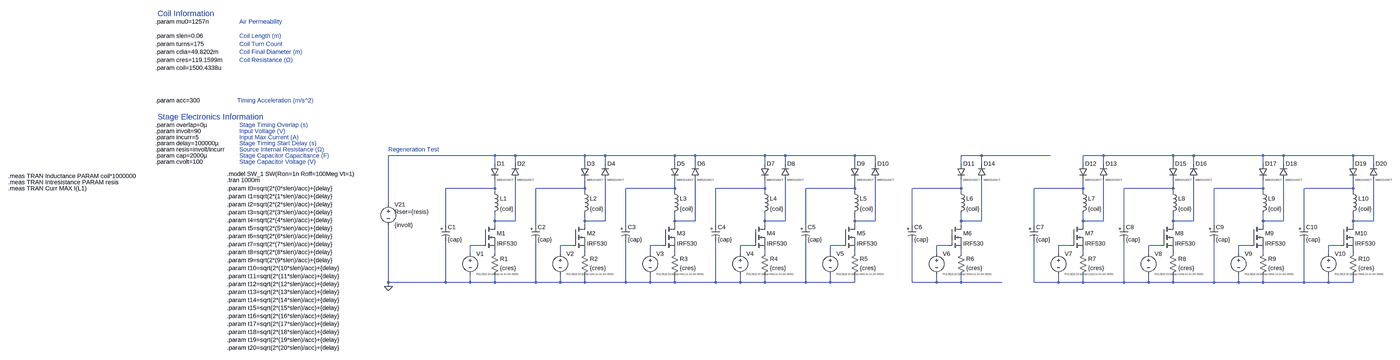
[diagram p0: schematic coilgun6.asc, whole sheet]
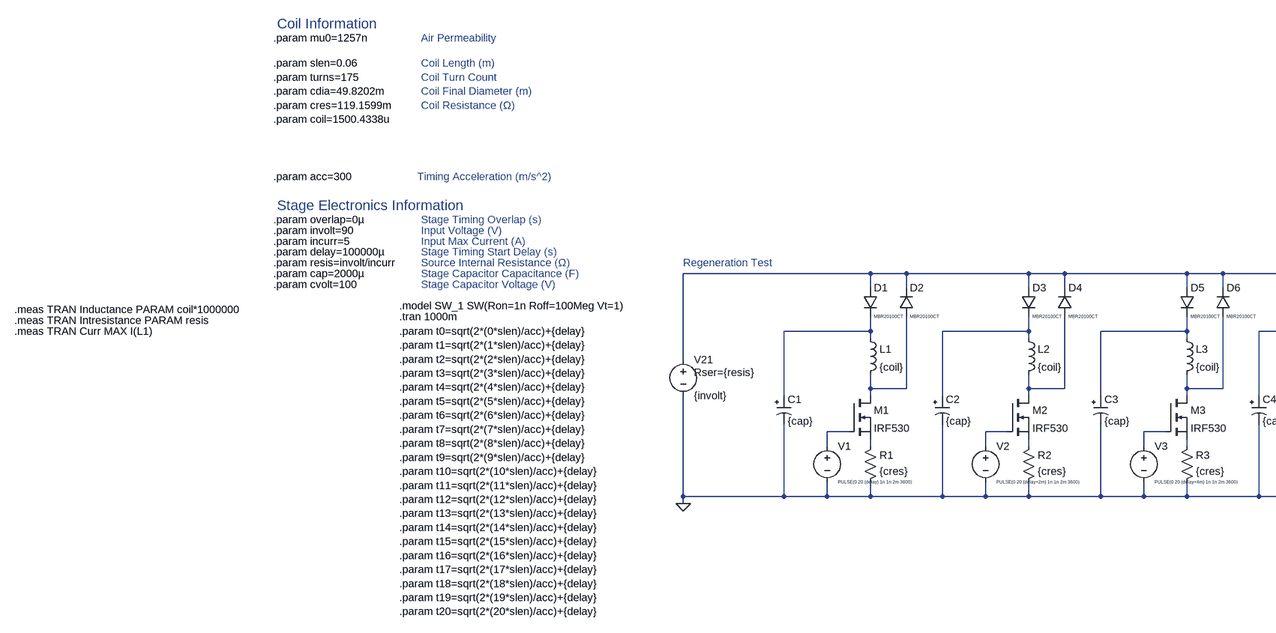
[diagram p1: schematic coilgun6.asc, part, row 1 of 1, column 1 of 2]
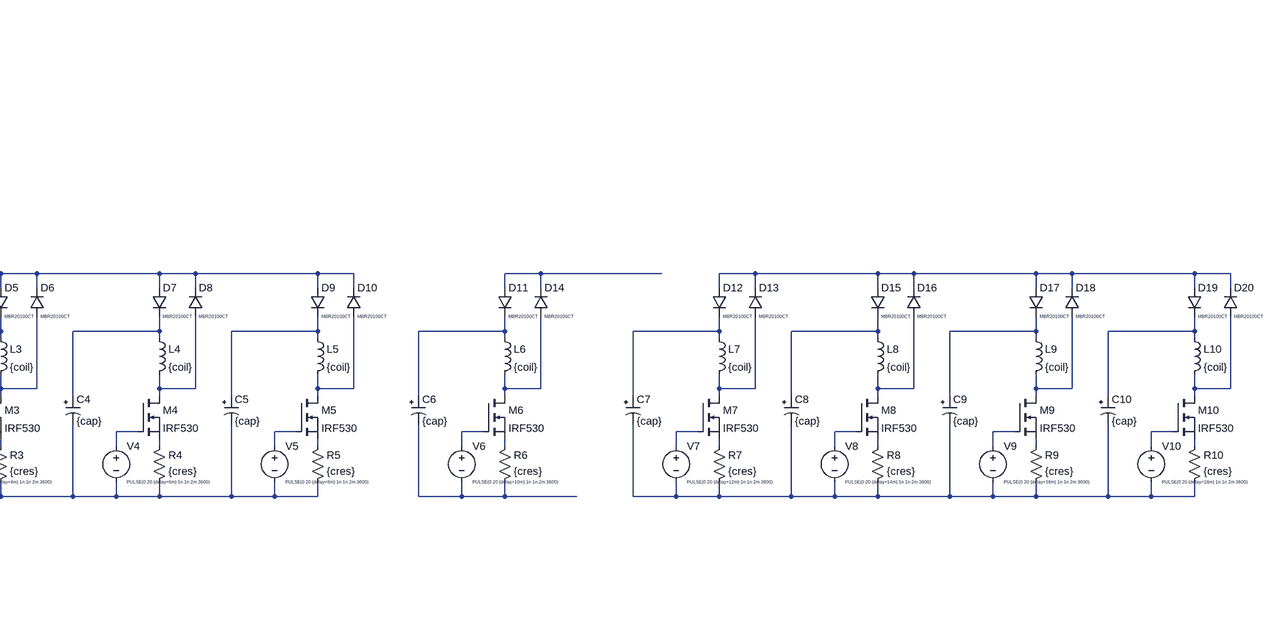
[diagram p2: schematic coilgun6.asc, part, row 1 of 1, column 2 of 2]
coilgun6.asc, the LTspice schematic file:
Version 4.1
SHEET 1 8016 1416
WIRE 128 -160 -288 -160
WIRE 208 -160 128 -160
WIRE 480 -160 208 -160
WIRE 560 -160 480 -160
WIRE 832 -160 560 -160
WIRE 912 -160 832 -160
WIRE 1184 -160 912 -160
WIRE 1264 -160 1184 -160
WIRE 1536 -160 1264 -160
WIRE 1616 -160 1536 -160
WIRE 2032 -160 1952 -160
WIRE 2304 -160 2032 -160
WIRE 2512 -160 2432 -160
WIRE 2784 -160 2512 -160
WIRE 2864 -160 2784 -160
WIRE 3136 -160 2864 -160
WIRE 3216 -160 3136 -160
WIRE 3488 -160 3216 -160
WIRE 3568 -160 3488 -160
WIRE 128 -128 128 -160
WIRE 208 -128 208 -160
WIRE 480 -128 480 -160
WIRE 560 -128 560 -160
WIRE 832 -128 832 -160
WIRE 912 -128 912 -160
WIRE 1184 -128 1184 -160
WIRE 1264 -128 1264 -160
WIRE 1536 -128 1536 -160
WIRE 1616 -128 1616 -160
WIRE 1952 -128 1952 -160
WIRE 2032 -128 2032 -160
WIRE 2432 -128 2432 -160
WIRE 2512 -128 2512 -160
WIRE 2784 -128 2784 -160
WIRE 2864 -128 2864 -160
WIRE 3136 -128 3136 -160
WIRE 3216 -128 3216 -160
WIRE 3488 -128 3488 -160
WIRE 3568 -128 3568 -160
WIRE 128 -32 128 -64
WIRE 128 -32 -64 -32
WIRE 480 -32 480 -64
WIRE 480 -32 288 -32
WIRE 832 -32 832 -64
WIRE 832 -32 640 -32
WIRE 1184 -32 1184 -64
WIRE 1184 -32 992 -32
WIRE 1536 -32 1536 -64
WIRE 1536 -32 1344 -32
WIRE 1952 -32 1952 -64
WIRE 1952 -32 1760 -32
WIRE 2432 -32 2432 -64
WIRE 2432 -32 2240 -32
WIRE 2784 -32 2784 -64
WIRE 2784 -32 2592 -32
WIRE 3136 -32 3136 -64
WIRE 3136 -32 2944 -32
WIRE 3488 -32 3488 -64
WIRE 3488 -32 3296 -32
WIRE 128 -16 128 -32
WIRE 480 -16 480 -32
WIRE 832 -16 832 -32
WIRE 1184 -16 1184 -32
WIRE 1536 -16 1536 -32
WIRE 1952 -16 1952 -32
WIRE 2432 -16 2432 -32
WIRE 2784 -16 2784 -32
WIRE 3136 -16 3136 -32
WIRE 3488 -16 3488 -32
WIRE -288 32 -288 -160
WIRE 128 96 128 64
WIRE 208 96 208 -64
WIRE 208 96 128 96
WIRE 480 96 480 64
WIRE 560 96 560 -64
WIRE 560 96 480 96
WIRE 832 96 832 64
WIRE 912 96 912 -64
WIRE 912 96 832 96
WIRE 1184 96 1184 64
WIRE 1264 96 1264 -64
WIRE 1264 96 1184 96
WIRE 1536 96 1536 64
WIRE 1616 96 1616 -64
WIRE 1616 96 1536 96
WIRE 1952 96 1952 64
WIRE 2032 96 2032 -64
WIRE 2032 96 1952 96
WIRE 2432 96 2432 64
WIRE 2512 96 2512 -64
WIRE 2512 96 2432 96
WIRE 2784 96 2784 64
WIRE 2864 96 2864 -64
WIRE 2864 96 2784 96
WIRE 3136 96 3136 64
WIRE 3216 96 3216 -64
WIRE 3216 96 3136 96
WIRE 3488 96 3488 64
WIRE 3568 96 3568 -64
WIRE 3568 96 3488 96
WIRE -64 112 -64 -32
WIRE 128 112 128 96
WIRE 288 112 288 -32
WIRE 480 112 480 96
WIRE 640 112 640 -32
WIRE 832 112 832 96
WIRE 992 112 992 -32
WIRE 1184 112 1184 96
WIRE 1344 112 1344 -32
WIRE 1536 112 1536 96
WIRE 1760 112 1760 -32
WIRE 1952 112 1952 96
WIRE 2240 112 2240 -32
WIRE 2432 112 2432 96
WIRE 2592 112 2592 -32
WIRE 2784 112 2784 96
WIRE 2944 112 2944 -32
WIRE 3136 112 3136 96
WIRE 3296 112 3296 -32
WIRE 3488 112 3488 96
WIRE 80 192 32 192
WIRE 432 192 384 192
WIRE 784 192 736 192
WIRE 1136 192 1088 192
WIRE 1488 192 1440 192
WIRE 1904 192 1856 192
WIRE 2384 192 2336 192
WIRE 2736 192 2688 192
WIRE 3088 192 3040 192
WIRE 3440 192 3392 192
WIRE 32 224 32 192
WIRE 128 224 128 208
WIRE 384 224 384 192
WIRE 480 224 480 208
WIRE 736 224 736 192
WIRE 832 224 832 208
WIRE 1088 224 1088 192
WIRE 1184 224 1184 208
WIRE 1440 224 1440 192
WIRE 1536 224 1536 208
WIRE 1856 224 1856 192
WIRE 1952 224 1952 208
WIRE 2336 224 2336 192
WIRE 2432 224 2432 208
WIRE 2688 224 2688 192
WIRE 2784 224 2784 208
WIRE 3040 224 3040 192
WIRE 3136 224 3136 208
WIRE 3392 224 3392 192
WIRE 3488 224 3488 208
WIRE -288 336 -288 112
WIRE -64 336 -64 176
WIRE -64 336 -288 336
WIRE 32 336 32 304
WIRE 32 336 -64 336
WIRE 128 336 128 304
WIRE 128 336 32 336
WIRE 288 336 288 176
WIRE 288 336 128 336
WIRE 384 336 384 304
WIRE 384 336 288 336
WIRE 480 336 480 304
WIRE 480 336 384 336
WIRE 640 336 640 176
WIRE 640 336 480 336
WIRE 736 336 736 304
WIRE 736 336 640 336
WIRE 832 336 832 304
WIRE 832 336 736 336
WIRE 992 336 992 176
WIRE 992 336 832 336
WIRE 1088 336 1088 304
WIRE 1088 336 992 336
WIRE 1184 336 1184 304
WIRE 1184 336 1088 336
WIRE 1344 336 1344 176
WIRE 1344 336 1184 336
WIRE 1440 336 1440 304
WIRE 1440 336 1344 336
WIRE 1536 336 1536 304
WIRE 1536 336 1440 336
WIRE 1760 336 1760 176
WIRE 1856 336 1856 304
WIRE 1856 336 1760 336
WIRE 1952 336 1952 304
WIRE 1952 336 1856 336
WIRE 2112 336 1952 336
WIRE 2240 336 2240 176
WIRE 2336 336 2336 304
WIRE 2336 336 2240 336
WIRE 2432 336 2432 304
WIRE 2432 336 2336 336
WIRE 2592 336 2592 176
WIRE 2592 336 2432 336
WIRE 2688 336 2688 304
WIRE 2688 336 2592 336
WIRE 2784 336 2784 304
WIRE 2784 336 2688 336
WIRE 2944 336 2944 176
WIRE 2944 336 2784 336
WIRE 3040 336 3040 304
WIRE 3040 336 2944 336
WIRE 3136 336 3136 304
WIRE 3136 336 3040 336
WIRE 3296 336 3296 176
WIRE 3296 336 3136 336
WIRE 3392 336 3392 304
WIRE 3392 336 3296 336
WIRE 3488 336 3488 304
WIRE 3488 336 3392 336
WIRE -288 352 -288 336
FLAG -288 352 0
SYMBOL voltage -288 16 R0
WINDOW 123 0 0 Left 0
WINDOW 39 24 44 Left 2
SYMATTR SpiceLine Rser={resis}
SYMATTR InstName V21
SYMATTR Value {involt}
SYMBOL diode 112 -128 R0
WINDOW 3 24 64 Left 0
SYMATTR Value MBR20100CT
SYMATTR InstName D1
SYMBOL ind 112 -32 R0
SYMATTR InstName L1
SYMATTR Value {coil}
SYMBOL nmos 80 112 R0
SYMATTR InstName M1
SYMATTR Value IRF530
SYMBOL voltage 32 208 R0
WINDOW 3 24 96 Left 0
WINDOW 123 0 0 Left 0
WINDOW 39 0 0 Left 0
SYMATTR Value PULSE(0 20 {delay} 1n 1n 2m 3600)
SYMATTR InstName V1
SYMBOL polcap -80 112 R0
SYMATTR InstName C1
SYMATTR Value {cap}
SYMATTR SpiceLine V={cvolt}
SYMBOL res 112 320 M180
WINDOW 0 36 76 Left 2
WINDOW 3 36 40 Left 2
SYMATTR InstName R1
SYMATTR Value {cres}
SYMBOL ind 464 -32 R0
SYMATTR InstName L2
SYMATTR Value {coil}
SYMBOL nmos 432 112 R0
SYMATTR InstName M2
SYMATTR Value IRF530
SYMBOL voltage 384 208 R0
WINDOW 3 24 96 Left 0
WINDOW 123 0 0 Left 0
WINDOW 39 0 0 Left 0
SYMATTR Value PULSE(0 20 {delay+2m} 1n 1n 2m 3600)
SYMATTR InstName V2
SYMBOL polcap 272 112 R0
SYMATTR InstName C2
SYMATTR Value {cap}
SYMATTR SpiceLine V={cvolt}
SYMBOL res 464 320 M180
WINDOW 0 36 76 Left 2
WINDOW 3 36 40 Left 2
SYMATTR InstName R2
SYMATTR Value {cres}
SYMBOL diode 464 -128 R0
WINDOW 3 24 64 Left 0
SYMATTR Value MBR20100CT
SYMATTR InstName D3
SYMBOL diode 544 -64 M180
WINDOW 3 24 0 Left 0
WINDOW 0 24 64 Left 2
SYMATTR Value MBR20100CT
SYMATTR InstName D4
SYMBOL diode 192 -64 M180
WINDOW 3 24 0 Left 0
WINDOW 0 24 64 Left 2
SYMATTR Value MBR20100CT
SYMATTR InstName D2
SYMBOL ind 816 -32 R0
SYMATTR InstName L3
SYMATTR Value {coil}
SYMBOL nmos 784 112 R0
SYMATTR InstName M3
SYMATTR Value IRF530
SYMBOL voltage 736 208 R0
WINDOW 3 24 96 Left 0
WINDOW 123 0 0 Left 0
WINDOW 39 0 0 Left 0
SYMATTR Value PULSE(0 20 {delay+4m} 1n 1n 2m 3600)
SYMATTR InstName V3
SYMBOL polcap 624 112 R0
SYMATTR InstName C3
SYMATTR Value {cap}
SYMATTR SpiceLine V={cvolt}
SYMBOL res 816 320 M180
WINDOW 0 36 76 Left 2
WINDOW 3 36 40 Left 2
SYMATTR InstName R3
SYMATTR Value {cres}
SYMBOL diode 816 -128 R0
WINDOW 3 24 64 Left 0
SYMATTR Value MBR20100CT
SYMATTR InstName D5
SYMBOL diode 896 -64 M180
WINDOW 3 24 0 Left 0
WINDOW 0 24 64 Left 2
SYMATTR Value MBR20100CT
SYMATTR InstName D6
SYMBOL ind 1168 -32 R0
SYMATTR InstName L4
SYMATTR Value {coil}
SYMBOL nmos 1136 112 R0
SYMATTR InstName M4
SYMATTR Value IRF530
SYMBOL voltage 1088 208 R0
WINDOW 3 24 96 Left 0
WINDOW 123 0 0 Left 0
WINDOW 39 0 0 Left 0
SYMATTR Value PULSE(0 20 {delay+6m} 1n 1n 2m 3600)
SYMATTR InstName V4
SYMBOL polcap 976 112 R0
SYMATTR InstName C4
SYMATTR Value {cap}
SYMATTR SpiceLine V={cvolt}
SYMBOL res 1168 320 M180
WINDOW 0 36 76 Left 2
WINDOW 3 36 40 Left 2
SYMATTR InstName R4
SYMATTR Value {cres}
SYMBOL diode 1168 -128 R0
WINDOW 3 24 64 Left 0
SYMATTR Value MBR20100CT
SYMATTR InstName D7
SYMBOL diode 1248 -64 M180
WINDOW 3 24 0 Left 0
WINDOW 0 24 64 Left 2
SYMATTR Value MBR20100CT
SYMATTR InstName D8
SYMBOL ind 1520 -32 R0
SYMATTR InstName L5
SYMATTR Value {coil}
SYMBOL nmos 1488 112 R0
SYMATTR InstName M5
SYMATTR Value IRF530
SYMBOL voltage 1440 208 R0
WINDOW 3 24 96 Left 0
WINDOW 123 0 0 Left 0
WINDOW 39 0 0 Left 0
SYMATTR Value PULSE(0 20 {delay+8m} 1n 1n 2m 3600)
SYMATTR InstName V5
SYMBOL polcap 1328 112 R0
SYMATTR InstName C5
SYMATTR Value {cap}
SYMATTR SpiceLine V={cvolt}
SYMBOL res 1520 320 M180
WINDOW 0 36 76 Left 2
WINDOW 3 36 40 Left 2
SYMATTR InstName R5
SYMATTR Value {cres}
SYMBOL diode 1520 -128 R0
WINDOW 3 24 64 Left 0
SYMATTR Value MBR20100CT
SYMATTR InstName D9
SYMBOL diode 1600 -64 M180
WINDOW 3 24 0 Left 0
WINDOW 0 24 64 Left 2
SYMATTR Value MBR20100CT
SYMATTR InstName D10
SYMBOL diode 1936 -128 R0
WINDOW 3 24 64 Left 0
SYMATTR Value MBR20100CT
SYMATTR InstName D11
SYMBOL ind 1936 -32 R0
SYMATTR InstName L6
SYMATTR Value {coil}
SYMBOL nmos 1904 112 R0
SYMATTR InstName M6
SYMATTR Value IRF530
SYMBOL voltage 1856 208 R0
WINDOW 3 24 96 Left 0
WINDOW 123 0 0 Left 0
WINDOW 39 0 0 Left 0
SYMATTR Value PULSE(0 20 {delay+10m} 1n 1n 2m 3600)
SYMATTR InstName V6
SYMBOL polcap 1744 112 R0
SYMATTR InstName C6
SYMATTR Value {cap}
SYMATTR SpiceLine V={cvolt}
SYMBOL res 1936 320 M180
WINDOW 0 36 76 Left 2
WINDOW 3 36 40 Left 2
SYMATTR InstName R6
SYMATTR Value {cres}
SYMBOL ind 2416 -32 R0
SYMATTR InstName L7
SYMATTR Value {coil}
SYMBOL nmos 2384 112 R0
SYMATTR InstName M7
SYMATTR Value IRF530
SYMBOL voltage 2336 208 R0
WINDOW 3 24 96 Left 0
WINDOW 123 0 0 Left 0
WINDOW 39 0 0 Left 0
SYMATTR Value PULSE(0 20 {delay+12m} 1n 1n 2m 3600)
SYMATTR InstName V7
SYMBOL polcap 2224 112 R0
SYMATTR InstName C7
SYMATTR Value {cap}
SYMATTR SpiceLine V={cvolt}
SYMBOL res 2416 320 M180
WINDOW 0 36 76 Left 2
WINDOW 3 36 40 Left 2
SYMATTR InstName R7
SYMATTR Value {cres}
SYMBOL diode 2416 -128 R0
WINDOW 3 24 64 Left 0
SYMATTR Value MBR20100CT
SYMATTR InstName D12
SYMBOL diode 2496 -64 M180
WINDOW 3 24 0 Left 0
WINDOW 0 24 64 Left 2
SYMATTR Value MBR20100CT
SYMATTR InstName D13
SYMBOL diode 2016 -64 M180
WINDOW 3 24 0 Left 0
WINDOW 0 24 64 Left 2
SYMATTR Value MBR20100CT
SYMATTR InstName D14
SYMBOL ind 2768 -32 R0
SYMATTR InstName L8
SYMATTR Value {coil}
SYMBOL nmos 2736 112 R0
SYMATTR InstName M8
SYMATTR Value IRF530
SYMBOL voltage 2688 208 R0
WINDOW 3 24 96 Left 0
WINDOW 123 0 0 Left 0
WINDOW 39 0 0 Left 0
SYMATTR Value PULSE(0 20 {delay+14m} 1n 1n 2m 3600)
SYMATTR InstName V8
SYMBOL polcap 2576 112 R0
SYMATTR InstName C8
SYMATTR Value {cap}
SYMATTR SpiceLine V={cvolt}
SYMBOL res 2768 320 M180
WINDOW 0 36 76 Left 2
WINDOW 3 36 40 Left 2
SYMATTR InstName R8
SYMATTR Value {cres}
SYMBOL diode 2768 -128 R0
WINDOW 3 24 64 Left 0
SYMATTR Value MBR20100CT
SYMATTR InstName D15
SYMBOL diode 2848 -64 M180
WINDOW 3 24 0 Left 0
WINDOW 0 24 64 Left 2
SYMATTR Value MBR20100CT
SYMATTR InstName D16
SYMBOL ind 3120 -32 R0
SYMATTR InstName L9
SYMATTR Value {coil}
SYMBOL nmos 3088 112 R0
SYMATTR InstName M9
SYMATTR Value IRF530
SYMBOL voltage 3040 208 R0
WINDOW 3 24 96 Left 0
WINDOW 123 0 0 Left 0
WINDOW 39 0 0 Left 0
SYMATTR Value PULSE(0 20 {delay+16m} 1n 1n 2m 3600)
SYMATTR InstName V9
SYMBOL polcap 2928 112 R0
SYMATTR InstName C9
SYMATTR Value {cap}
SYMATTR SpiceLine V={cvolt}
SYMBOL res 3120 320 M180
WINDOW 0 36 76 Left 2
WINDOW 3 36 40 Left 2
SYMATTR InstName R9
SYMATTR Value {cres}
SYMBOL diode 3120 -128 R0
WINDOW 3 24 64 Left 0
SYMATTR Value MBR20100CT
SYMATTR InstName D17
SYMBOL diode 3200 -64 M180
WINDOW 3 24 0 Left 0
WINDOW 0 24 64 Left 2
SYMATTR Value MBR20100CT
SYMATTR InstName D18
SYMBOL ind 3472 -32 R0
SYMATTR InstName L10
SYMATTR Value {coil}
SYMBOL nmos 3440 112 R0
SYMATTR InstName M10
SYMATTR Value IRF530
SYMBOL voltage 3392 208 R0
WINDOW 3 24 96 Left 0
WINDOW 123 0 0 Left 0
WINDOW 39 0 0 Left 0
SYMATTR Value PULSE(0 20 {delay+18m} 1n 1n 2m 3600)
SYMATTR InstName V10
SYMBOL polcap 3280 112 R0
SYMATTR InstName C10
SYMATTR Value {cap}
SYMATTR SpiceLine V={cvolt}
SYMBOL res 3472 320 M180
WINDOW 0 36 76 Left 2
WINDOW 3 36 40 Left 2
SYMATTR InstName R10
SYMATTR Value {cres}
SYMBOL diode 3472 -128 R0
WINDOW 3 24 64 Left 0
SYMATTR Value MBR20100CT
SYMATTR InstName D19
SYMBOL diode 3552 -64 M180
WINDOW 3 24 0 Left 0
WINDOW 0 24 64 Left 2
SYMATTR Value MBR20100CT
SYMATTR InstName D20
TEXT -944 -64 Left 2 !.tran 1000m
TEXT -944 -88 Left 2 !.model SW_1 SW(Ron=1n Roff=100Meg Vt=1)
TEXT -288 -184 Left 2 ;Regeneration Test
TEXT -944 -32 Left 2 !.param t0=sqrt(2*(0*slen)/acc)+{delay}\n.param t1=sqrt(2*(1*slen)/acc)+{delay}\n.param t2=sqrt(2*(2*slen)/acc)+{delay}\n.param t3=sqrt(2*(3*slen)/acc)+{delay}\n.param t4=sqrt(2*(4*slen)/acc)+{delay}\n.param t5=sqrt(2*(5*slen)/acc)+{delay}\n.param t6=sqrt(2*(6*slen)/acc)+{delay}\n.param t7=sqrt(2*(7*slen)/acc)+{delay}\n.param t8=sqrt(2*(8*slen)/acc)+{delay}\n.param t9=sqrt(2*(9*slen)/acc)+{delay}\n.param t10=sqrt(2*(10*slen)/acc)+{delay}\n.param t11=sqrt(2*(11*slen)/acc)+{delay}\n.param t12=sqrt(2*(12*slen)/acc)+{delay}\n.param t13=sqrt(2*(13*slen)/acc)+{delay}\n.param t14=sqrt(2*(14*slen)/acc)+{delay}\n.param t15=sqrt(2*(15*slen)/acc)+{delay}\n.param t16=sqrt(2*(16*slen)/acc)+{delay}\n.param t17=sqrt(2*(17*slen)/acc)+{delay}\n.param t18=sqrt(2*(18*slen)/acc)+{delay}\n.param t19=sqrt(2*(19*slen)/acc)+{delay}\n.param t20=sqrt(2*(20*slen)/acc)+{delay}
TEXT -1224 -376 Left 2 !.param acc=300
TEXT -1224 -280 Left 2 !.param overlap=0µ
TEXT -1224 -256 Left 2 !.param involt=90
TEXT -1224 -704 Left 2 !.param mu0=1257n
TEXT -1800 -80 Left 2 !.meas TRAN Inductance PARAM coil*1000000
TEXT -1224 -208 Left 2 !.param delay=100000µ
TEXT -1224 -184 Left 2 !.param resis=involt/incurr
TEXT -1224 -160 Left 2 !.param cap=2000µ
TEXT -896 -280 Left 2 ;Stage Timing Overlap (s)
TEXT -896 -256 Left 2 ;Input Voltage (V)
TEXT -896 -208 Left 2 ;Stage Timing Start Delay (s)
TEXT -896 -184 Left 2 ;Source Internal Resistance (Ω)
TEXT -896 -160 Left 2 ;Stage Capacitor Capacitance (F)
TEXT -896 -704 Left 2 ;Air Permeability
TEXT -1216 -312 Left 3 ;Stage Electronics Information
TEXT -904 -376 Left 2 ;Timing Acceleration (m/s^2)
TEXT -1224 -136 Left 2 !.param cvolt=100
TEXT -896 -136 Left 2 ;Stage Capacitor Voltage (V)
TEXT -1224 -232 Left 2 !.param incurr=5
TEXT -896 -232 Left 2 ;Input Max Current (A)
TEXT -1800 -56 Left 2 !.meas TRAN Intresistance PARAM resis
TEXT -1216 -736 Left 3 ;Coil Information
TEXT -1224 -648 Left 2 !.param slen=0.06\n.param turns=175\n.param cdia=49.8202m\n.param cres=119.1599m\n.param coil=1500.4338u
TEXT -896 -648 Left 2 ;Coil Length (m)\nCoil Turn Count\nCoil Final Diameter (m)\nCoil Resistance (Ω)
TEXT -1800 -32 Left 2 !.meas TRAN Curr MAX I(L1)

The netlist it stands for:
* coilgun6.asc
V21 N001 0 {involt} Rser={resis}
D1 N001 N004 MBR20100CT
L1 N004 N014 {coil}
M1 N014 N024 N034 N034 IRF530
V1 N024 0 PULSE(0 20 {delay} 1n 1n 2m 3600)
C1 N004 0 {cap} V={cvolt}
R1 0 N034 {cres}
L2 N005 N015 {coil}
M2 N015 N025 N035 N035 IRF530
V2 N025 0 PULSE(0 20 {delay+2m} 1n 1n 2m 3600)
C2 N005 0 {cap} V={cvolt}
R2 0 N035 {cres}
D3 N001 N005 MBR20100CT
D4 N015 N001 MBR20100CT
D2 N014 N001 MBR20100CT
L3 N006 N016 {coil}
M3 N016 N026 N036 N036 IRF530
V3 N026 0 PULSE(0 20 {delay+4m} 1n 1n 2m 3600)
C3 N006 0 {cap} V={cvolt}
R3 0 N036 {cres}
D5 N001 N006 MBR20100CT
D6 N016 N001 MBR20100CT
L4 N007 N017 {coil}
M4 N017 N027 N037 N037 IRF530
V4 N027 0 PULSE(0 20 {delay+6m} 1n 1n 2m 3600)
C4 N007 0 {cap} V={cvolt}
R4 0 N037 {cres}
D7 N001 N007 MBR20100CT
D8 N017 N001 MBR20100CT
L5 N008 N018 {coil}
M5 N018 N028 N038 N038 IRF530
V5 N028 0 PULSE(0 20 {delay+8m} 1n 1n 2m 3600)
C5 N008 0 {cap} V={cvolt}
R5 0 N038 {cres}
D9 N001 N008 MBR20100CT
D10 N018 N001 MBR20100CT
D11 N002 N009 MBR20100CT
L6 N009 N019 {coil}
M6 N019 N029 N039 N039 IRF530
V6 N029 N044 PULSE(0 20 {delay+10m} 1n 1n 2m 3600)
C6 N009 N044 {cap} V={cvolt}
R6 N044 N039 {cres}
L7 N010 N020 {coil}
M7 N020 N030 N040 N040 IRF530
V7 N030 N045 PULSE(0 20 {delay+12m} 1n 1n 2m 3600)
C7 N010 N045 {cap} V={cvolt}
R7 N045 N040 {cres}
D12 N003 N010 MBR20100CT
D13 N020 N003 MBR20100CT
D14 N019 N002 MBR20100CT
L8 N011 N021 {coil}
M8 N021 N031 N041 N041 IRF530
V8 N031 N045 PULSE(0 20 {delay+14m} 1n 1n 2m 3600)
C8 N011 N045 {cap} V={cvolt}
R8 N045 N041 {cres}
D15 N003 N011 MBR20100CT
D16 N021 N003 MBR20100CT
L9 N012 N022 {coil}
M9 N022 N032 N042 N042 IRF530
V9 N032 N045 PULSE(0 20 {delay+16m} 1n 1n 2m 3600)
C9 N012 N045 {cap} V={cvolt}
R9 N045 N042 {cres}
D17 N003 N012 MBR20100CT
D18 N022 N003 MBR20100CT
L10 N013 N023 {coil}
M10 N023 N033 N043 N043 IRF530
V10 N033 N045 PULSE(0 20 {delay+18m} 1n 1n 2m 3600)
C10 N013 N045 {cap} V={cvolt}
R10 N045 N043 {cres}
D19 N003 N013 MBR20100CT
D20 N023 N003 MBR20100CT
.model D D
.lib standard.dio
.model NMOS NMOS
.model PMOS PMOS
.lib standard.mos
.tran 1000m
.model SW_1 SW(Ron=1n Roff=100Meg Vt=1)
* Regeneration Test
.param t0=sqrt(2*(0*slen)/acc)+{delay}
.param t1=sqrt(2*(1*slen)/acc)+{delay}
.param t2=sqrt(2*(2*slen)/acc)+{delay}
.param t3=sqrt(2*(3*slen)/acc)+{delay}
.param t4=sqrt(2*(4*slen)/acc)+{delay}
.param t5=sqrt(2*(5*slen)/acc)+{delay}
.param t6=sqrt(2*(6*slen)/acc)+{delay}
.param t7=sqrt(2*(7*slen)/acc)+{delay}
.param t8=sqrt(2*(8*slen)/acc)+{delay}
.param t9=sqrt(2*(9*slen)/acc)+{delay}
.param t10=sqrt(2*(10*slen)/acc)+{delay}
.param t11=sqrt(2*(11*slen)/acc)+{delay}
.param t12=sqrt(2*(12*slen)/acc)+{delay}
.param t13=sqrt(2*(13*slen)/acc)+{delay}
.param t14=sqrt(2*(14*slen)/acc)+{delay}
.param t15=sqrt(2*(15*slen)/acc)+{delay}
.param t16=sqrt(2*(16*slen)/acc)+{delay}
.param t17=sqrt(2*(17*slen)/acc)+{delay}
.param t18=sqrt(2*(18*slen)/acc)+{delay}
.param t19=sqrt(2*(19*slen)/acc)+{delay}
.param t20=sqrt(2*(20*slen)/acc)+{delay}
.param acc=300
.param overlap=0µ
.param involt=90
.param mu0=1257n
.meas TRAN Inductance PARAM coil*1000000
.param delay=100000µ
.param resis=involt/incurr
.param cap=2000µ
* Stage Timing Overlap (s)
* Input Voltage (V)
* Stage Timing Start Delay (s)
* Source Internal Resistance (Ω)
* Stage Capacitor Capacitance (F)
* Air Permeability
* Stage Electronics Information
* Timing Acceleration (m/s^2)
.param cvolt=100
* Stage Capacitor Voltage (V)
.param incurr=5
* Input Max Current (A)
.meas TRAN Intresistance PARAM resis
* Coil Information
.param slen=0.06
.param turns=175
.param cdia=49.8202m
.param cres=119.1599m
.param coil=1500.4338u
* Coil Length (m)
* Coil Turn Count
* Coil Final Diameter (m)
* Coil Resistance (Ω)
.meas TRAN Curr MAX I(L1)
.backanno
.end